# Altium project Vreg_Learning_Platform.PrjPcb (part 5 of 5)

## Sheet Output.SchDoc: <Project Name>
size A3; ApprovedBy: <Appr.>; Author: <Author>; CompanyName: Infineon Technologies AG; Engineer: <Rel.>; Organization: Infineon Technologies AG; Address1: IFAG DES S PS; Address2: Am Campeon 1-12  -  85579 Neubiberg  -  Germany; Address3: 85579 Neubiberg; Address4: Germany; DocumentNumber: 8; Revision: <Rev.>; SheetNumber: 8; SheetTotal: 9; Release: RC00; PageSetup: Record=PageOptions|CenterHorizontal=True|CenterVertical=True|PrintScale=1.01|XCorrection=1.00|YCorrection=1.00|PrintKind=0|BorderSize=5000000|LeftOffset=0|BottomOffset=0|Orientation=2|PaperLength=1000|PaperWidth=1000|Scale=100|PaperSource=7|PrintQuality=-4|MediaType=1|DitherType=10|PaperKind=A3|PrintScaleMode=1; Doc_ConfidentialStatus: <Doc_ConfidentialStatus>; Doc_Preliminary: <Doc_Preliminary>
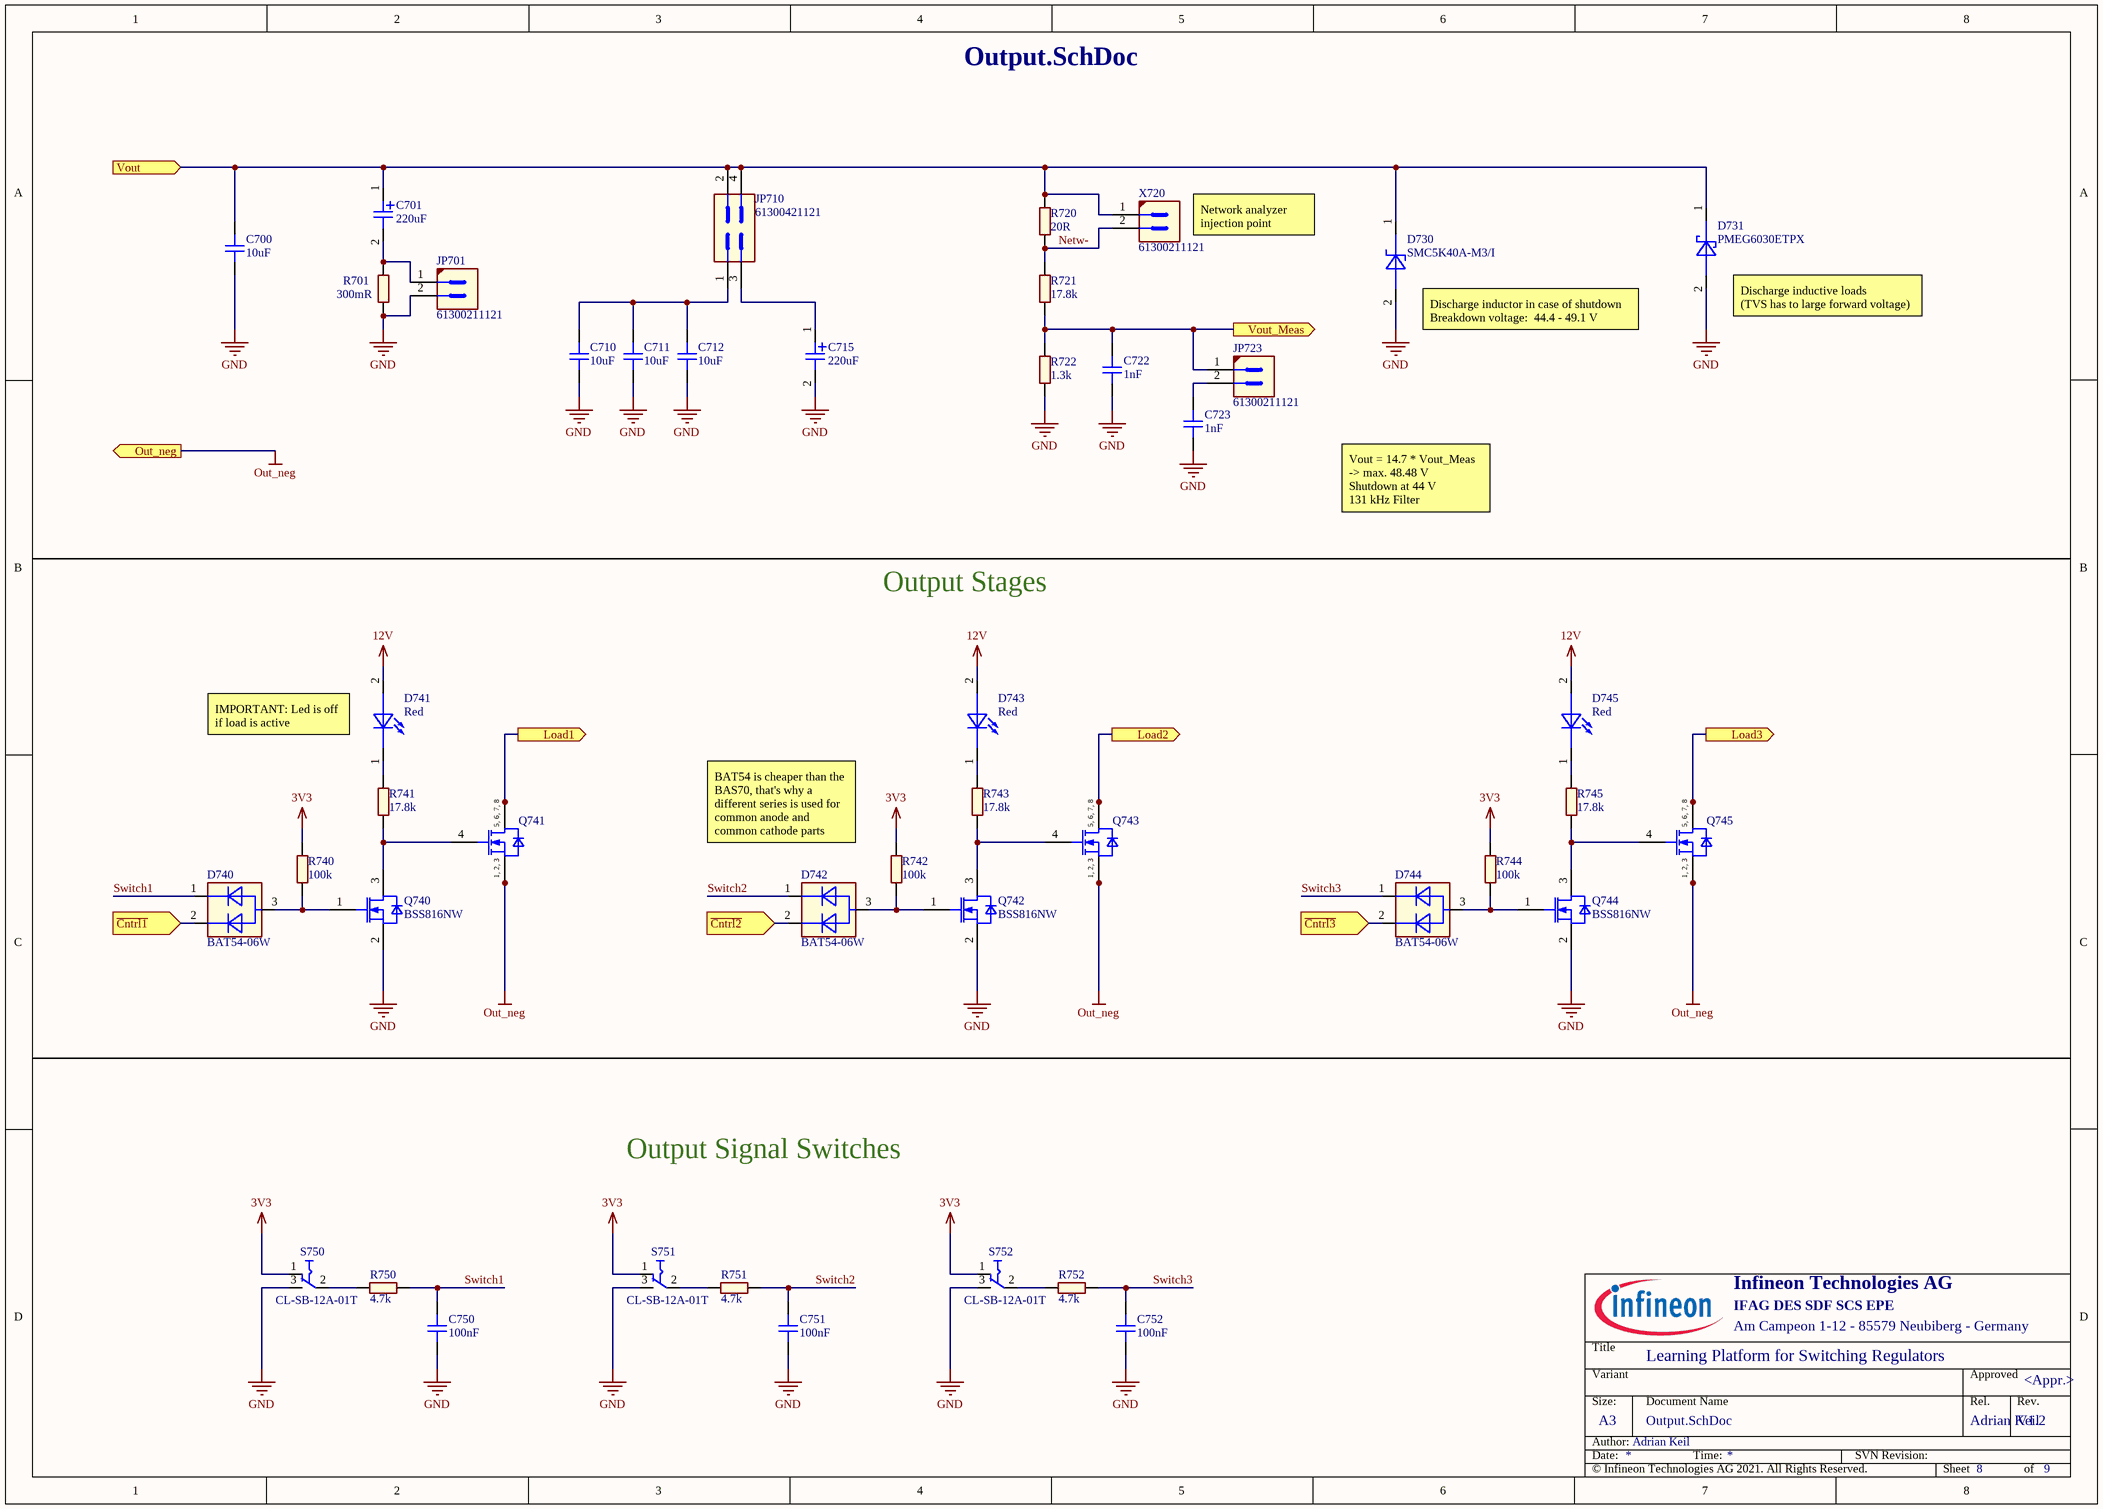
[diagram p5: Output.SchDoc]

### Parts
C700  10uF  [CAPC3216X190N-1]
C701  220uF  [CAPAE1030X1050N-2]
C710  10uF  [CAPC3216X190N-1]
C711  10uF  [CAPC3216X190N-1]
C712  10uF  [CAPC3216X190N-1]
C715  220uF  [CAPAE1030X1050N-2]
C722  1nF  [CAPC1608X87N-1]
C723  1nF  [CAPC1608X87N-1]
C750  100nF  [CAPC1608X90N-2]
C751  100nF  [CAPC1608X90N-2]
C752  100nF  [CAPC1608X90N-2]
D730  SMC5K40A-M3/I  [DIOM7959X262N]
D731  PMEG6030ETPX  [SODFL4725X110N]
D740  BAT54-06W  [SOT65P210X100-3N-1-V]
D741  Red  [LEDSC160X80X80-2N-1]
D742  BAT54-06W  [SOT65P210X100-3N-1-V]
D743  Red  [LEDSC160X80X80-2N-1]
D744  BAT54-06W  [SOT65P210X100-3N-1-V]
D745  Red  [LEDSC160X80X80-2N-1]
JP701  61300211121  [CON-M-THT-61300211121]
JP710  61300421121  [CON-M-THT-61300421121]
JP723  61300211121  [CON-M-THT-61300211121]
Q740  BSS816NW  [SOT65P210X100-3N-1-V]
Q741  igfet_n_ch_enh_dio_1s2s3s4g5d6d7d8d_8p  [INF-PG-TSDSON-8-FL]  (value not drawn)
Q742  BSS816NW  [SOT65P210X100-3N-1-V]
Q743  igfet_n_ch_enh_dio_1s2s3s4g5d6d7d8d_8p  [INF-PG-TSDSON-8-FL]  (value not drawn)
Q744  BSS816NW  [SOT65P210X100-3N-1-V]
Q745  igfet_n_ch_enh_dio_1s2s3s4g5d6d7d8d_8p  [INF-PG-TSDSON-8-FL]  (value not drawn)
R701  300mR  [RESC6432X89N-1]
R720  20R  [RESC1609X50N]
R721  17.8k  [RESC1609X50N]
R722  1.3k  [RESC1609X50N]
R740  100k  [RESC1609X50N]
R741  17.8k  [RESC1609X50N]
R742  100k  [RESC1609X50N]
R743  17.8k  [RESC1609X50N]
R744  100k  [RESC1609X50N]
R745  17.8k  [RESC1609X50N]
R750  4.7k  [RESC1609X50N]
R751  4.7k  [RESC1609X50N]
R752  4.7k  [RESC1609X50N]
S750  CL-SB-12A-01T  [SW-SMD-CL-SB-12A-01T]
S751  CL-SB-12A-01T  [SW-SMD-CL-SB-12A-01T]
S752  CL-SB-12A-01T  [SW-SMD-CL-SB-12A-01T]
X720  61300211121  [CON-M-THT-61300211121]

### Ports
Load1 (out), Load2 (out), Load3 (out), Out_neg (out), Vout (in), Vout_Meas (out), ~{Cntrl1} (in), ~{Cntrl2} (in), ~{Cntrl3} (in)

### Nets
3V3: R740.2 R742.2 R744.2 S750.1 S751.1 S752.1
12V: D741.2(Anode) D743.2(Anode) D745.2(Anode)
GND: C700.1 C710.1 C711.1 C712.1 C715.2 C722.1 C723.1 C750.1 C751.1 C752.1 D730.2(ANODE) D731.2(Anode) JP701.2 Q740.2(SOURCE) Q742.2(SOURCE) Q744.2(SOURCE) R701.1 R722.1 S750.3 S751.3 S752.3
Out_neg: Q741.1(SOURCE) Q741.2(SOURCE) Q741.3(SOURCE) Q743.1(SOURCE) Q743.2(SOURCE) Q743.3(SOURCE) Q745.1(SOURCE) Q745.2(SOURCE) Q745.3(SOURCE) ; port Out_neg
~{Cntrl1}: D740.2(CATHODE2) ; port ~{Cntrl1}
~{Cntrl2}: D742.2(CATHODE2) ; port ~{Cntrl2}
~{Cntrl3}: D744.2(CATHODE2) ; port ~{Cntrl3}
Load1: Q741.5(DRAIN) Q741.6(DRAIN) Q741.7(DRAIN) Q741.8(DRAIN) ; port Load1
Load2: Q743.5(DRAIN) Q743.6(DRAIN) Q743.7(DRAIN) Q743.8(DRAIN) ; port Load2
Load3: Q745.5(DRAIN) Q745.6(DRAIN) Q745.7(DRAIN) Q745.8(DRAIN) ; port Load3
Netw-: R720.1 R721.1 X720.2
Switch1: C750.2 D740.1(CATHODE1) R750.2
Switch2: C751.2 D742.1(CATHODE1) R751.2
Switch3: C752.2 D744.1(CATHODE1) R752.2
Vout: C700.2 C701.1 D730.1(CATHODE) D731.1(Cathode) JP710.2 JP710.4 R720.2 X720.1 ; port Vout
Vout_Meas: C722.2 JP723.1 R721.2 R722.2 ; port Vout_Meas
NetC701_2: C701.2 JP701.1 R701.2
NetC710_2: C710.2 C711.2 C712.2 JP710.1
NetC715_1: C715.1 JP710.3
NetC723_2: C723.2 JP723.2
NetD740_3: D740.3(ANODE) Q740.1(GATE) R740.1
NetD741_1: D741.1(Cathode) R741.2
NetD742_3: D742.3(ANODE) Q742.1(GATE) R742.1
NetD743_1: D743.1(Cathode) R743.2
NetD744_3: D744.3(ANODE) Q744.1(GATE) R744.1
NetD745_1: D745.1(Cathode) R745.2
NetQ740_3: Q740.3(DRAIN) Q741.4(GATE) R741.1
NetQ742_3: Q742.3(DRAIN) Q743.4(GATE) R743.1
NetQ744_3: Q744.3(DRAIN) Q745.4(GATE) R745.1
NetR750_1: R750.1 S750.2
NetR751_1: R751.1 S751.2
NetR752_1: R752.1 S752.2

### Notes on the sheet
- Network analyzer injection point
- (near D731) Discharge inductive loads
  (TVS has to large forward voltage)
- (near D730) Discharge inductor in case of shutdown
  Breakdown voltage:  44.4 - 49.1 V
- Vout = 14.7 * Vout_Meas
  -> max. 48.48 V
  Shutdown at 44 V
  131 kHz Filter
- Output Stages
- (near D741) IMPORTANT: Led is off if load is active
- BAT54 is cheaper than the BAS70, that's why a different series is used for common anode and common cathode parts
- Output Signal Switches
- Title
- Variant
- Approved
- Date:
- Author:
- Size:
- A3
- Document Name
- Time:
- SVN Revision:
- Rel.
- Rev.
- Sheet
- of
- (in symbol 422114) 5, 6, 7, 8; 1, 2, 3

### Library data of the parts
C700 C710-C712 = 648992: CAP / CERA / 10uF / 50V / 20% / X5R (EIA) / -55°C to 85°C / 1206 (3216) / SMD / -; Multiple Parts: No; Manufacturer: Taiyo Yuden; Manufacturer Order Number: UMK316BBJ106ML-T; Symbol Type: Capacitor; Single; Standard; 2 Pins; Alternate View: Yes; Article Number: 648992; Version Number: V00; Combined Parameters: TC:X5R (EIA);Tol.:-20%/+20%;Vdc:50V; QuickPick: 10uF / 50V / 20% / X5R (EIA) / 1206 (3216); Type: Standard; Style: Single; ComponentStatus: Released; PLMStatus: Active; Part Type: Capacitor; Value: 10uF; Tolerance Neg: 20%; Tolerance Pos: 20%; Application: Standard; Technology: Ceramic; Temperature min: -55; Temperature max: 85; Temperature Range: Military; ROHS Compliant: Y; Automotive Qualified: No; PackageReference: 1206 (3216); ComponentLink1Description: Vendor WebSite; ComponentLink1URL: http://www.yuden.co.jp/or/product/; ComponentLink2Description: Datasheet; ComponentLink2URL: http://webnetprod.muc.infineon.com/PCBPortal_Prod/WorkFlows/AltiumComponent/StandardDocumentation?Versionid=648993; Supplier 1: Farnell; Supplier Part Number 1: 2779059; Supplier 2: DigiKey; Supplier Part Number 2: 587-3248-1-ND; Supplier 3: Mouser; Supplier Part Number 3: 963-UMK316BBJ106ML-T; Second Source allowed: Yes; Voltage DC (max): 50V; Package Description: Capacitor,non-polarized,Chip;3.20mm L X 1.60mm W X 1.90mm H
C701 C715 = 646791: CAP / ELCO / 220uF / 50V / 20% / Aluminiumelectrolytic / -55°C to 105°C / 10.30mm L X 10.30mm W X 10.50mm H / SMD / -; Multible Parts: No; Manufacturer: Wurth Elektronik; Manufacturer Order Number: 865080657018; Symbol Type: Capacitor; Single; Polarized; 2 Pins; Pin 1 Positive; Alternate View: Yes; Article Number: 646791; Version Number: V01; Combined Parameters: TC:Aluminiumelectrolytic;Tol.:-20%/+20%;Vdc:50V; QuickPick: 220uF / 50V / 20% / Aluminiumelectrolytic / SMD; Type: Polarized; Style: Single; ComponentStatus: Released; PLMStatus: Active; Part Type: Capacitor; Value: 220uF; Tolerance Neg: 20%; Tolerance Pos: 20%; Application: Standard; Technology: Electrolytic; Temperature min: -55; Temperature max: 105; Temperature Range: Military; ROHS Compliant: Y; Automotive Qualified: No; PackageReference: SMD; ComponentLink1Description: Vendor WebSite; ComponentLink1URL: http://www.we-online.com; ComponentLink2Description: Datasheet; ComponentLink2URL: http://webnetprod.muc.infineon.com/PCBPortal_Prod/WorkFlows/AltiumComponent/StandardDocumentation?Versionid=646792; Supplier 1: Farnell; Supplier Part Number 1: 2466345; Supplier 2: DigiKey; Supplier Part Number 2: 732-8463-1-ND; Supplier 3: Mouser; Supplier Part Number 3: 710-865080657018; Second Source allowed: Yes; Voltage DC (max): 50V; Package Description: Capacitor,Aluminum Electrolytic;10.30mm L X 10.30mm W X 10.50mm H
C722 C723 = 527788: CAP / CERA / 1nF / 50V / 10% / X7R (EIA) / -55°C to 125°C / 0603 (1608) / SMD / -; Multiple Parts: No; Manufacturer: Wurth Elektronik; Manufacturer Order Number: 885012206083; Symbol Type: Capacitor; Single; Standard; 2 Pins; Alternate View: Yes; Article Number: 527788; Version Number: V01; Combined Parameters: TC:X7R (EIA);Tol.:-10%/+10%;Vdc:50V; QuickPick: 1nF / 50V / 10% / X7R (EIA) / 0603 (1608); Type: Standard; Style: Single; ComponentStatus: Released; PLMStatus: Active; Part Type: Capacitor; Value: 1nF; Tolerance Neg: 10%; Tolerance Pos: 10%; Application: Standard; Technology: Ceramic; Temperature min: -55; Temperature max: 125; Temperature Range: Military; ROHS Compliant: Y; Automotive Qualified: No; PackageReference: 0603 (1608); ComponentLink1Description: Vendor WebSite; ComponentLink1URL: http://www.we-online.com; ComponentLink2Description: Datasheet; ComponentLink2URL: http://webnetprod.muc.infineon.com/PCBPortal_Prod/WorkFlows/AltiumComponent/StandardDocumentation?Versionid=527789; Supplier 1: Farnell; Supplier Part Number 1: 2495178; Supplier 2: DigiKey; Supplier Part Number 2: 732-8001-1-ND; Supplier 3: Mouser; Supplier Part Number 3: 710-885012206083; Second Source allowed: Yes; Voltage DC (max): 50V; Package Description: Capacitor,non-polarized,Chip;1.60mm L X 0.80mm W X 0.87mm H
C750-C752 = 479045: CAP / CERA / 100nF / 50V / 10% / X7R (EIA) / -55°C to 125°C / 0603 / SMD / -; Multiple Parts: No; Manufacturer: AVX; Manufacturer Order Number: 06035C104KAT2A; Symbol Type: Capacitor; Single; Standard; 2 Pins; Alternate View: Yes; Article Number: 479045; Version Number: V01; Combined Parameters: TC:X7R (EIA);Tol.:-10%/+10%;Vdc:50V; QuickPick: 100nF / 50V / 10% / X7R (EIA) / 0603; Type: Standard; Style: Single; ComponentStatus: Released; PLMStatus: Active; Part Type: Capacitor; Value: 100nF; Tolerance Neg: 10%; Tolerance Pos: 10%; Application: Standard; Technology: Ceramic; Temperature min: -55; Temperature max: 125; Temperature Range: Military; ROHS Compliant: Y; Automotive Qualified: No; PackageReference: 0603; ComponentLink1Description: Vendor WebSite; ComponentLink1URL: http://www.avx.com; ComponentLink2Description: Datasheet; ComponentLink2URL: http://webnetprod.muc.infineon.com/PCBPortal_Prod/WorkFlows/AltiumComponent/StandardDocumentation?Versionid=479046; Supplier 1: Farnell; Supplier Part Number 1: 2280883; Supplier 2: DigiKey; Supplier Part Number 2: 478-5052-2-ND; Supplier 3: Mouser; Supplier Part Number 3: 581-06035C104KAT2A; Second Source allowed: Yes; Voltage DC (max): 50V; Package Description: Capacitor,non-polarized,Chip;1.60mm L X 0.81mm W X 0.90mm H
D730 = 646377: Surface Mount Transient Voltage Suppressors, Unidirectional, Very Fast Response Time; Manufacturer: Vishay; Symbol Type: Transient Voltage Suppressor Diode (TVS, TAZ), 1 Cathode, 2 Anode; Article Number: 646377; Version Number: V01; Combined Parameters: Vf:-;If:-;Ur:40V;Ir:-;Pmax:5kW; QuickPick: TVS Diode / SMC (DO-214AB); Type: TVS Diode; Style: Single; Automotive Qualified: AEC Q101; ComponentStatus: Released; PLMStatus: Active; Second Source allowed: Yes; Voltage DC (max): na; Part Type: Diode; Manufacturer Order Number: SMC5K40A-M3/I; Value: SMC5K40A-M3/I; Application: Switching; Temperature min: -55; Temperature max: 150; Temperature Range: Military; ROHS Compliant: Y; PackageReference: SMC (DO-214AB); ComponentLink1Description: Vendor WebSite; ComponentLink1URL: http://www.vishay.com; ComponentLink2Description: Datasheet; ComponentLink2URL: http://webnetprod.muc.infineon.com/PCBPortal_Prod/WorkFlows/AltiumComponent/StandardDocumentation?Versionid=646378; Supplier 1: Farnell; Supplier 2: DigiKey; Supplier Part Number 2: SMC5K40A-M3/IGICT-ND; Supplier 3: Mouser; Supplier Part Number 3: 78-SMC5K40A-M3/I; Package Description: Diode,Molded Body;7.94mm L X 5.905mm W X 2.62mm H
D731 = 646087: DIODE SCHOTTKY 60V 3A SOD128; Manufacturer: Nexperia; Symbol Type: Standard Schottky Diode Symbol, 1 Cathode, 2 Anode; Article Number: 646087; Version Number: V01; Combined Parameters: Vf:530mV;If:4.2A;Ur:60V;Ir:200uA;Pmax:750mW; QuickPick: Schottky Diode / SOD128; Type: Schottky Diode; Style: Single; Automotive Qualified: AEC Q101; ComponentStatus: Released; PLMStatus: Active; Second Source allowed: Yes; Voltage DC (max): na; Part Type: Diode; Manufacturer Order Number: PMEG6030ETPX; Value: PMEG6030ETPX; Application: Standard; Temperature min: -55; Temperature max: 175; Temperature Range: Military; ROHS Compliant: Y; PackageReference: SOD128; ComponentLink1Description: Vendor WebSite; ComponentLink1URL: http://www.nexperia.com; ComponentLink2Description: Datasheet; ComponentLink2URL: http://webnetprod.muc.infineon.com/PCBPortal_Prod/WorkFlows/AltiumComponent/StandardDocumentation?Versionid=646088; Supplier 1: Farnell; Supplier Part Number 1: 2311228; Supplier 2: DigiKey; Supplier Part Number 2: 1727-1348-1-ND; Supplier 3: Mouser; Supplier Part Number 3: 771-PMEG6030ETPX; Package Description: SODFL Diode;3.80mm W X 2.50mm L X 1.10mm H body
D740 D742 D744 = 646372: Silicon Schottky Diodes; Manufacturer: Infineon Technologies; Symbol type: Dual Diode Symbol 3 Pins, 1 Cathode, 2 Cathode, 3 Anode; Article Number: 646372; Version Number: V01; Combined Parameters: Vf:800mV;If:200mA;Ur:30V;Ir:2uA;Pmax:230mW; QuickPick: Schottky Diode / PG-SOT323-3-1; Style: Dual; Automotive Qualified: AEC Q101; ComponentStatus: Released; PLMStatus: Active; Second Source allowed: Yes; Voltage DC (max): na; Part Type: Diode; Manufacturer Order Number: BAT54-06W; Value: BAT54-06W; Type: Schottky Diode; Application: Standard; Temperature min: -65; Temperature max: 150; Temperature Range: Military; ROHS Compliant: Y; PackageReference: PG-SOT323-3-1; ComponentLink1Description: Vendor WebSite; ComponentLink1URL: https://www.infineon.com/; ComponentLink2Description: Datasheet; ComponentLink2URL: http://webnetprod.muc.infineon.com/PCBPortal_Prod/WorkFlows/AltiumComponent/StandardDocumentation?Versionid=646373; Supplier 1: Farnell; Supplier Part Number 1: 2787842; Supplier 2: DigiKey; Supplier Part Number 2: BAT5406WH6327XTSA1TR-ND; Supplier 3: Mouser; Package Description: SOT,0.65mm pitch;3 pin,1.25mm W X 2.00mm L X 1.00mm H body
D741 D743 D745 = 625459: as D550-D553 on sheet Safety; Part Type: Diode; Value: Red; Type: LED; Application: Standard; Temperature min: -40; Temperature max: 85; Temperature Range: Industrial; ROHS Compliant: Y; PackageReference: 1608 (0603); ComponentLink1Description: Vendor WebSite; ComponentLink1URL: http://www.we-online.com; ComponentLink2Description: Datasheet; ComponentLink2URL: http://webnetprod.muc.infineon.com/PCBPortal_Prod/WorkFlows/AltiumComponent/StandardDocumentation?Versionid=625460; Supplier 1: Farnell; Supplier Part Number 1: 2322071; Supplier 2: DigiKey; Supplier Part Number 2: 732-4978-1-ND; Supplier 3: Mouser; Supplier Part Number 3: 710-150060RS75000; Package Description: LED,Side Concave; 2 pin,1.60mm W X 0.80mm L X 0.80mm H
JP701 JP723 X720 = 386760: Header, 2.54mm Pitch, 2 pin, Vertical, Single Row; Legacy PartNumber: CON01500943; Manufacturer: Wurth Elektronik; Alternat View: Yes; Article Number: 386760; Version Number: V01; Legacy DeviceID: WE_61300211121; Combined Parameters: Board-to-Board Header (male);2x1;Mounting:THT;Orient:0° (vertical);Shielded:No; QuickPick: 0° (vertical) / Board-to-Board; Style: Strip; Automotive Qualified: No; ComponentStatus: Released; PLMStatus: Active; Voltage DC (max): na; Part Type: Connector; Manufacturer Order Number: 61300211121; Value: 61300211121; Type: Board-to-Board; Temperature min: -40; Temperature max: 105; Temperature Range: Industrial; ROHS Compliant: Y; ComponentLink1Description: Vendor WebSite; ComponentLink1URL: http://www.we-online.com; ComponentLink2Description: Datasheet; ComponentLink2URL: http://webnetprod.muc.infineon.com/PCBPortal_Prod/WorkFlows/AltiumComponent/StandardDocumentation?Versionid=386761; Supplier 1: Farnell; Supplier Part Number 1: 2356153; Supplier 2: DigiKey; Supplier Part Number 2: 732-5315-ND; Supplier 3: Mouser; Supplier Part Number 3: 710-61300211121; Second Source allowed: Yes; Package Description: Header, Vertical, 2.54mm Pitch; 2 Pins, Single row, 5.08mm L X 2.54mm W X 8.89mm H body
JP710 = 624445: Header, 4pins, 2.54mm pitch, Board to Board; Manufacturer: Wurth Elektronik; Article Number: 624445; Version Number: V01; Legacy DeviceID: WE_61300421121; Combined Parameters: Board-to-Board Header (male);2x2;Mounting:THT;Orient:0° (vertical);Shielded:No; QuickPick: 0° (vertical) / Board-to-Board; Style: Strip; Automotive Qualified: No; ComponentStatus: Released; PLMStatus: Active; Second Source allowed: Yes; Voltage DC (max): na; Part Type: Connector; Manufacturer Order Number: 61300421121; Value: 61300421121; Type: Board-to-Board; Temperature min: -40; Temperature max: 105; Temperature Range: Industrial; ROHS Compliant: Y; PackageReference: THT; ComponentLink1Description: Vendor WebSite; ComponentLink1URL: http://www.we-online.com; ComponentLink2Description: Datasheet; ComponentLink2URL: http://webnetprod.muc.infineon.com/PCBPortal_Prod/WorkFlows/AltiumComponent/StandardDocumentation?Versionid=624446; Supplier 1: Farnell; Supplier Part Number 1: 2356130; Supplier 2: DigiKey; Supplier Part Number 2: 732-5294-ND; Supplier 3: Mouser; Supplier Part Number 3: 710-61300421121; Package Description: Connector, THT, 2.54mm pitch, 4 pins,5.08mm L X 5.08mm W X 8.89mm H body
Q740 Q742 Q744 = 644598: as Q550-Q553 on sheet Safety; Part Type: Transistor FET; Manufacturer Order Number: BSS816NW; Value: BSS816NW; Application: Small Signal; Temperature min: -55; Temperature max: 150; Temperature Range: Military; ROHS Compliant: Y; PackageReference: PG-SOT323-3-2; ComponentLink1Description: Vendor WebSite; ComponentLink1URL: https://www.infineon.com/; ComponentLink2Description: Datasheet; ComponentLink2URL: http://webnetprod.muc.infineon.com/PCBPortal_Prod/WorkFlows/AltiumComponent/StandardDocumentation?Versionid=644599; Supplier 1: Farnell; Supplier Part Number 1: 2617470; Supplier 2: DigiKey; Supplier Part Number 2: BSS816NWH6327XTSA1CT-ND; Supplier 3: Mouser; Supplier Part Number 3: 726-SP000917562; Package Description: SOT,0.65mm pitch;3 pin,1.25mm W X 2.00mm L X 1.00mm H body
Q741 Q743 Q745 = 422114: OptiMOS Power - MOSFET, 60 V; Legacy PartNumber: IFX01400359; Manufacturer: Infineon Technologies; Manufacturer Order Number: BSZ100N06NS; Symbol Type: Insulated-Gate Field-Effect Transistor (IGFET), N-Channel, Enhancement, Body Diode, Pin 1 Source, 2 Source, 3 Source, 4 Gate, 5 Drain, 6 Drain, 7 Drain, 8 Drain, 8 Pins; Article Number: 422114; Version Number: V01; Legacy DeviceID: IFX_BSZ100N06NS; Value: BSZ100N06NS; Combined Parameters: N-Channel;Uds:60V;Id:40A;Rds:10mR;P:36W; QuickPick: N-Channel / 36W / 40A / 60V / PG-TSDSON-8 FL; Type: N-Channel; Style: Single; Automotive Qualified: No; ComponentStatus: Released; PLMStatus: Active; Second Source allowed: Yes; Voltage DC (max): na; Part Type: Transistor FET; Application: Power Supply; Temperature min: -55; Temperature max: 150; Temperature Range: Military; ROHS Compliant: N; PackageReference: PG-TSDSON-8 FL; ComponentLink1Description: Vendor WebSite; ComponentLink1URL: https://www.infineon.com/; ComponentLink2Description: Datasheet; ComponentLink2URL: http://webnetprod.muc.infineon.com/PCBPortal_Prod/WorkFlows/AltiumComponent/StandardDocumentation?Versionid=422115; Supplier 1: Farnell; Supplier Part Number 1: 2709918; Supplier 2: DigiKey; Supplier Part Number 2: BSZ100N06NSATMA1TR-ND; Supplier 3: Mouser; Supplier Part Number 3: 726-BSZ100N06NSATMA1; Package Description: SON,0.65mm pitch;8 pin,3.3mm W X 3.3mm L X 1.10mm H body
R701 = 513799: RES / STD / 300mR / 1W / 1% / 75ppm/K / -65°C to 170°C / 2512 / SMD / -; Multiple Parts: No; Manufacturer: Vishay; Manufacturer Order Number: WSL2512R3000FEA; Symbol Type: Resistor; Single; Standard; 2 Pins; Alternate View: Yes; Article Number: 513799; Version Number: V01; Combined Parameters: TCR:75ppm/K;Tol.:-1%/+1%;Vdc:-;Idc:-;P:1W; QuickPick: 300mR / 1% / 1 / 2512; Style: Single; Automotive Qualified: AEC Q200; ComponentStatus: Released; PLMStatus: Active; Part Type: Resistor; Value: 300mR; Tolerance Neg: 1%; Tolerance Pos: 1%; Type: Standard; Application: Standard; Technology: Power Metal Strip; Temperature min: -65; Temperature max: 170; Temperature Range: Military; ROHS Compliant: Y; PackageReference: 2512; ComponentLink1Description: Vendor WebSite; ComponentLink1URL: http://www.vishay.com; ComponentLink2Description: Datasheet; ComponentLink2URL: http://webnetprod.muc.infineon.com/PCBPortal_Prod/WorkFlows/AltiumComponent/StandardDocumentation?Versionid=513800; Supplier 1: Farnell; Supplier Part Number 1: 1107412; Supplier 2: DigiKey; Supplier Part Number 2: WSLG-.30CT-ND; Supplier 3: Mouser; Supplier Part Number 3: 71-WSL2512R3000FEA; Second Source allowed: Yes; Package Description: Resistor,Chip;6.35mm L X 3.18mm W X 0.889mm H
R720 = 344622: RES / STD / 20R / 100mW / 1% / 100ppm/K / -55°C to 155°C / 0603 / SMD / -; Multiple Parts: No; Legacy PartNumber: RES01800947; Manufacturer: Vishay; Manufacturer Order Number: CRCW060320R0FK; Symbol Type: Resistor; Single; Standard; 2 Pins; Alternate View: Yes; Article Number: 344622; Version Number: V01; Combined Parameters: TCR:100ppm/K;Tol.:-1%/+1%;Vdc:75V;Idc:-;P:100mW; QuickPick: 20R / 1% / 0.1 / 0603; Style: Single; Automotive Qualified: AEC Q200; ComponentStatus: Released; PLMStatus: Active; Voltage DC (max): 75V; Legacy DeviceID: RES01800947; Part Type: Resistor; Value: 20R; Tolerance Neg: 1%; Tolerance Pos: 1%; Type: Standard; Technology: Thick Film; Temperature min: -55; Temperature max: 155; Temperature Range: Military; ROHS Compliant: Y; PackageReference: 0603; ComponentLink1Description: Vendor WebSite; ComponentLink1URL: http://www.vishay.com; ComponentLink2Description: Datasheet; ComponentLink2URL: http://webnetprod.muc.infineon.com/PCBPortal_Prod/WorkFlows/AltiumComponent/StandardDocumentation?Versionid=344623; Supplier 1: Farnell; Supplier 2: DigiKey; Supplier 3: Mouser; Second Source allowed: Yes
R721 R741 R743 R745 = 346302: RES / STD / 17.8k / 100mW / 1% / 100ppm/K / -55°C to 155°C / 0603 / SMD / -; Multiple Parts: No; Legacy PartNumber: RES01801283; Manufacturer: Vishay; Manufacturer Order Number: CRCW060317K8FK; Symbol Type: Resistor; Single; Standard; 2 Pins; Alternate View: Yes; Article Number: 346302; Version Number: V01; Combined Parameters: TCR:100ppm/K;Tol.:-1%/+1%;Vdc:75V;Idc:-;P:100mW; QuickPick: 17.8k / 1% / 0.1 / 0603; Style: Single; Automotive Qualified: AEC Q200; ComponentStatus: Released; PLMStatus: Active; Voltage DC (max): 75V; Legacy DeviceID: RES01801283; Part Type: Resistor; Value: 17.8k; Tolerance Neg: 1%; Tolerance Pos: 1%; Type: Standard; Technology: Thick Film; Temperature min: -55; Temperature max: 155; Temperature Range: Military; ROHS Compliant: Y; PackageReference: 0603; ComponentLink1Description: Vendor WebSite; ComponentLink1URL: http://www.vishay.com; ComponentLink2Description: Datasheet; ComponentLink2URL: http://webnetprod.muc.infineon.com/PCBPortal_Prod/WorkFlows/AltiumComponent/StandardDocumentation?Versionid=346303; Supplier 1: Farnell; Supplier 2: DigiKey; Supplier 3: Mouser; Second Source allowed: Yes
R722 = 345662: RES / STD / 1.3k / 100mW / 1% / 100ppm/K / -55°C to 155°C / 0603 / SMD / -; Multiple Parts: No; Legacy PartNumber: RES01801155; Manufacturer: Vishay; Manufacturer Order Number: CRCW06031K30FK; Symbol Type: Resistor; Single; Standard; 2 Pins; Alternate View: Yes; Article Number: 345662; Version Number: V01; Combined Parameters: TCR:100ppm/K;Tol.:-1%/+1%;Vdc:75V;Idc:-;P:100mW; QuickPick: 1.3k / 1% / 0.1 / 0603; Style: Single; Automotive Qualified: AEC Q200; ComponentStatus: Released; PLMStatus: Active; Voltage DC (max): 75V; Legacy DeviceID: RES01801155; Part Type: Resistor; Value: 1.3k; Tolerance Neg: 1%; Tolerance Pos: 1%; Type: Standard; Technology: Thick Film; Temperature min: -55; Temperature max: 155; Temperature Range: Military; ROHS Compliant: Y; PackageReference: 0603; ComponentLink1Description: Vendor WebSite; ComponentLink1URL: http://www.vishay.com; ComponentLink2Description: Datasheet; ComponentLink2URL: http://webnetprod.muc.infineon.com/PCBPortal_Prod/WorkFlows/AltiumComponent/StandardDocumentation?Versionid=345663; Supplier 1: Farnell; Supplier 2: DigiKey; Supplier 3: Mouser; Second Source allowed: Yes
R740 R742 R744 = 346742: RES / STD / 100k / 100mW / 1% / 100ppm/K / -55°C to 155°C / 0603 / SMD / -; Multiple Parts: No; Legacy PartNumber: RES01801371; Manufacturer: Vishay; Manufacturer Order Number: CRCW0603100KFK; Symbol Type: Resistor; Single; Standard; 2 Pins; Alternate View: Yes; Article Number: 346742; Version Number: V01; Combined Parameters: TCR:100ppm/K;Tol.:-1%/+1%;Vdc:75V;Idc:-;P:100mW; QuickPick: 100k / 1% / 0.1 / 0603; Style: Single; Automotive Qualified: AEC Q200; ComponentStatus: Released; PLMStatus: Active; Voltage DC (max): 75V; Legacy DeviceID: RES01801371; Part Type: Resistor; Value: 100k; Tolerance Neg: 1%; Tolerance Pos: 1%; Type: Standard; Technology: Thick Film; Temperature min: -55; Temperature max: 155; Temperature Range: Military; ROHS Compliant: Y; PackageReference: 0603; ComponentLink1Description: Vendor WebSite; ComponentLink1URL: http://www.vishay.com; ComponentLink2Description: Datasheet; ComponentLink2URL: http://webnetprod.muc.infineon.com/PCBPortal_Prod/WorkFlows/AltiumComponent/StandardDocumentation?Versionid=346743; Supplier 1: Farnell; Supplier Part Number 1: 1469649; Supplier 2: DigiKey; Supplier 3: Mouser; Second Source allowed: Yes
R750-R752 = 345982: RES / STD / 4.7k / 100mW / 1% / 100ppm/K / -55°C to 155°C / 0603 / SMD / -; Multiple Parts: No; Legacy PartNumber: RES01801219; Manufacturer: Vishay; Manufacturer Order Number: CRCW06034K70FK; Symbol Type: Resistor; Single; Standard; 2 Pins; Alternate View: Yes; Article Number: 345982; Version Number: V01; Combined Parameters: TCR:100ppm/K;Tol.:-1%/+1%;Vdc:75V;Idc:-;P:100mW; QuickPick: 4.7k / 1% / 0.1 / 0603; Style: Single; Automotive Qualified: AEC Q200; ComponentStatus: Released; PLMStatus: Active; Voltage DC (max): 75V; Legacy DeviceID: RES01801219; Part Type: Resistor; Value: 4.7k; Tolerance Neg: 1%; Tolerance Pos: 1%; Type: Standard; Technology: Thick Film; Temperature min: -55; Temperature max: 155; Temperature Range: Military; ROHS Compliant: Y; PackageReference: 0603; ComponentLink1Description: Vendor WebSite; ComponentLink1URL: http://www.vishay.com; ComponentLink2Description: Datasheet; ComponentLink2URL: http://webnetprod.muc.infineon.com/PCBPortal_Prod/WorkFlows/AltiumComponent/StandardDocumentation?Versionid=345983; Supplier 1: Farnell; Supplier 2: DigiKey; Supplier 3: Mouser; Second Source allowed: Yes
S750-S752 = 650099: Slid Switch, 12V, 200mA; Manufacturer: NIDEC COPAL ELECTRONICS, Inc.; Symbol Type: Switch, 2 Change Over 1 3, 3 Pins; Article Number: 650099; Version Number: V00; Automotive Qualified: No; ComponentStatus: Released; PLMStatus: Active; Second Source allowed: Yes; Voltage DC (max): na; Part Type: Electro Mechanic; Manufacturer Order Number: CL-SB-12A-01T; Value: CL-SB-12A-01T; Application: Power; Temperature min: -40; Temperature max: 85; Temperature Range: Industrial; ROHS Compliant: Y; ComponentLink1Description: Vendor WebSite; ComponentLink1URL: www.copal-electronics.com/; ComponentLink2Description: Datasheet; ComponentLink2URL: http://webnetprod.muc.infineon.com/PCBPortal_Prod/WorkFlows/AltiumComponent/StandardDocumentation?Versionid=650100; Supplier 1: Farnell; Supplier Part Number 1: 2854744; Supplier 2: DigiKey; Supplier Part Number 2: 563-1314-1-ND; Supplier 3: Mouser; Supplier Part Number 3: 229-CL-SB-12A-01T; Package Description: Switch, SMD, 3 Pins, 3.50 mm W X 8.50 mm L X 6.10 mm H body

## Sheet CurrentSensors.SchDoc: <Project Name>
size A3; ApprovedBy: <Appr.>; Author: <Author>; CompanyName: Infineon Technologies AG; Engineer: <Rel.>; Organization: Infineon Technologies AG; Address1: IFAG DES S PS; Address2: Am Campeon 1-12  -  85579 Neubiberg  -  Germany; Address3: 85579 Neubiberg; Address4: Germany; DocumentNumber: 7; Revision: <Rev.>; SheetNumber: 7; SheetTotal: 9; Release: RC00; PageSetup: Record=PageOptions|CenterHorizontal=True|CenterVertical=True|PrintScale=1.01|XCorrection=1.00|YCorrection=1.00|PrintKind=0|BorderSize=5000000|LeftOffset=0|BottomOffset=0|Orientation=2|PaperLength=1000|PaperWidth=1000|Scale=100|PaperSource=7|PrintQuality=-4|MediaType=1|DitherType=10|PaperKind=A3|PrintScaleMode=1; Doc_ConfidentialStatus: <Doc_ConfidentialStatus>; Doc_Preliminary: <Doc_Preliminary>
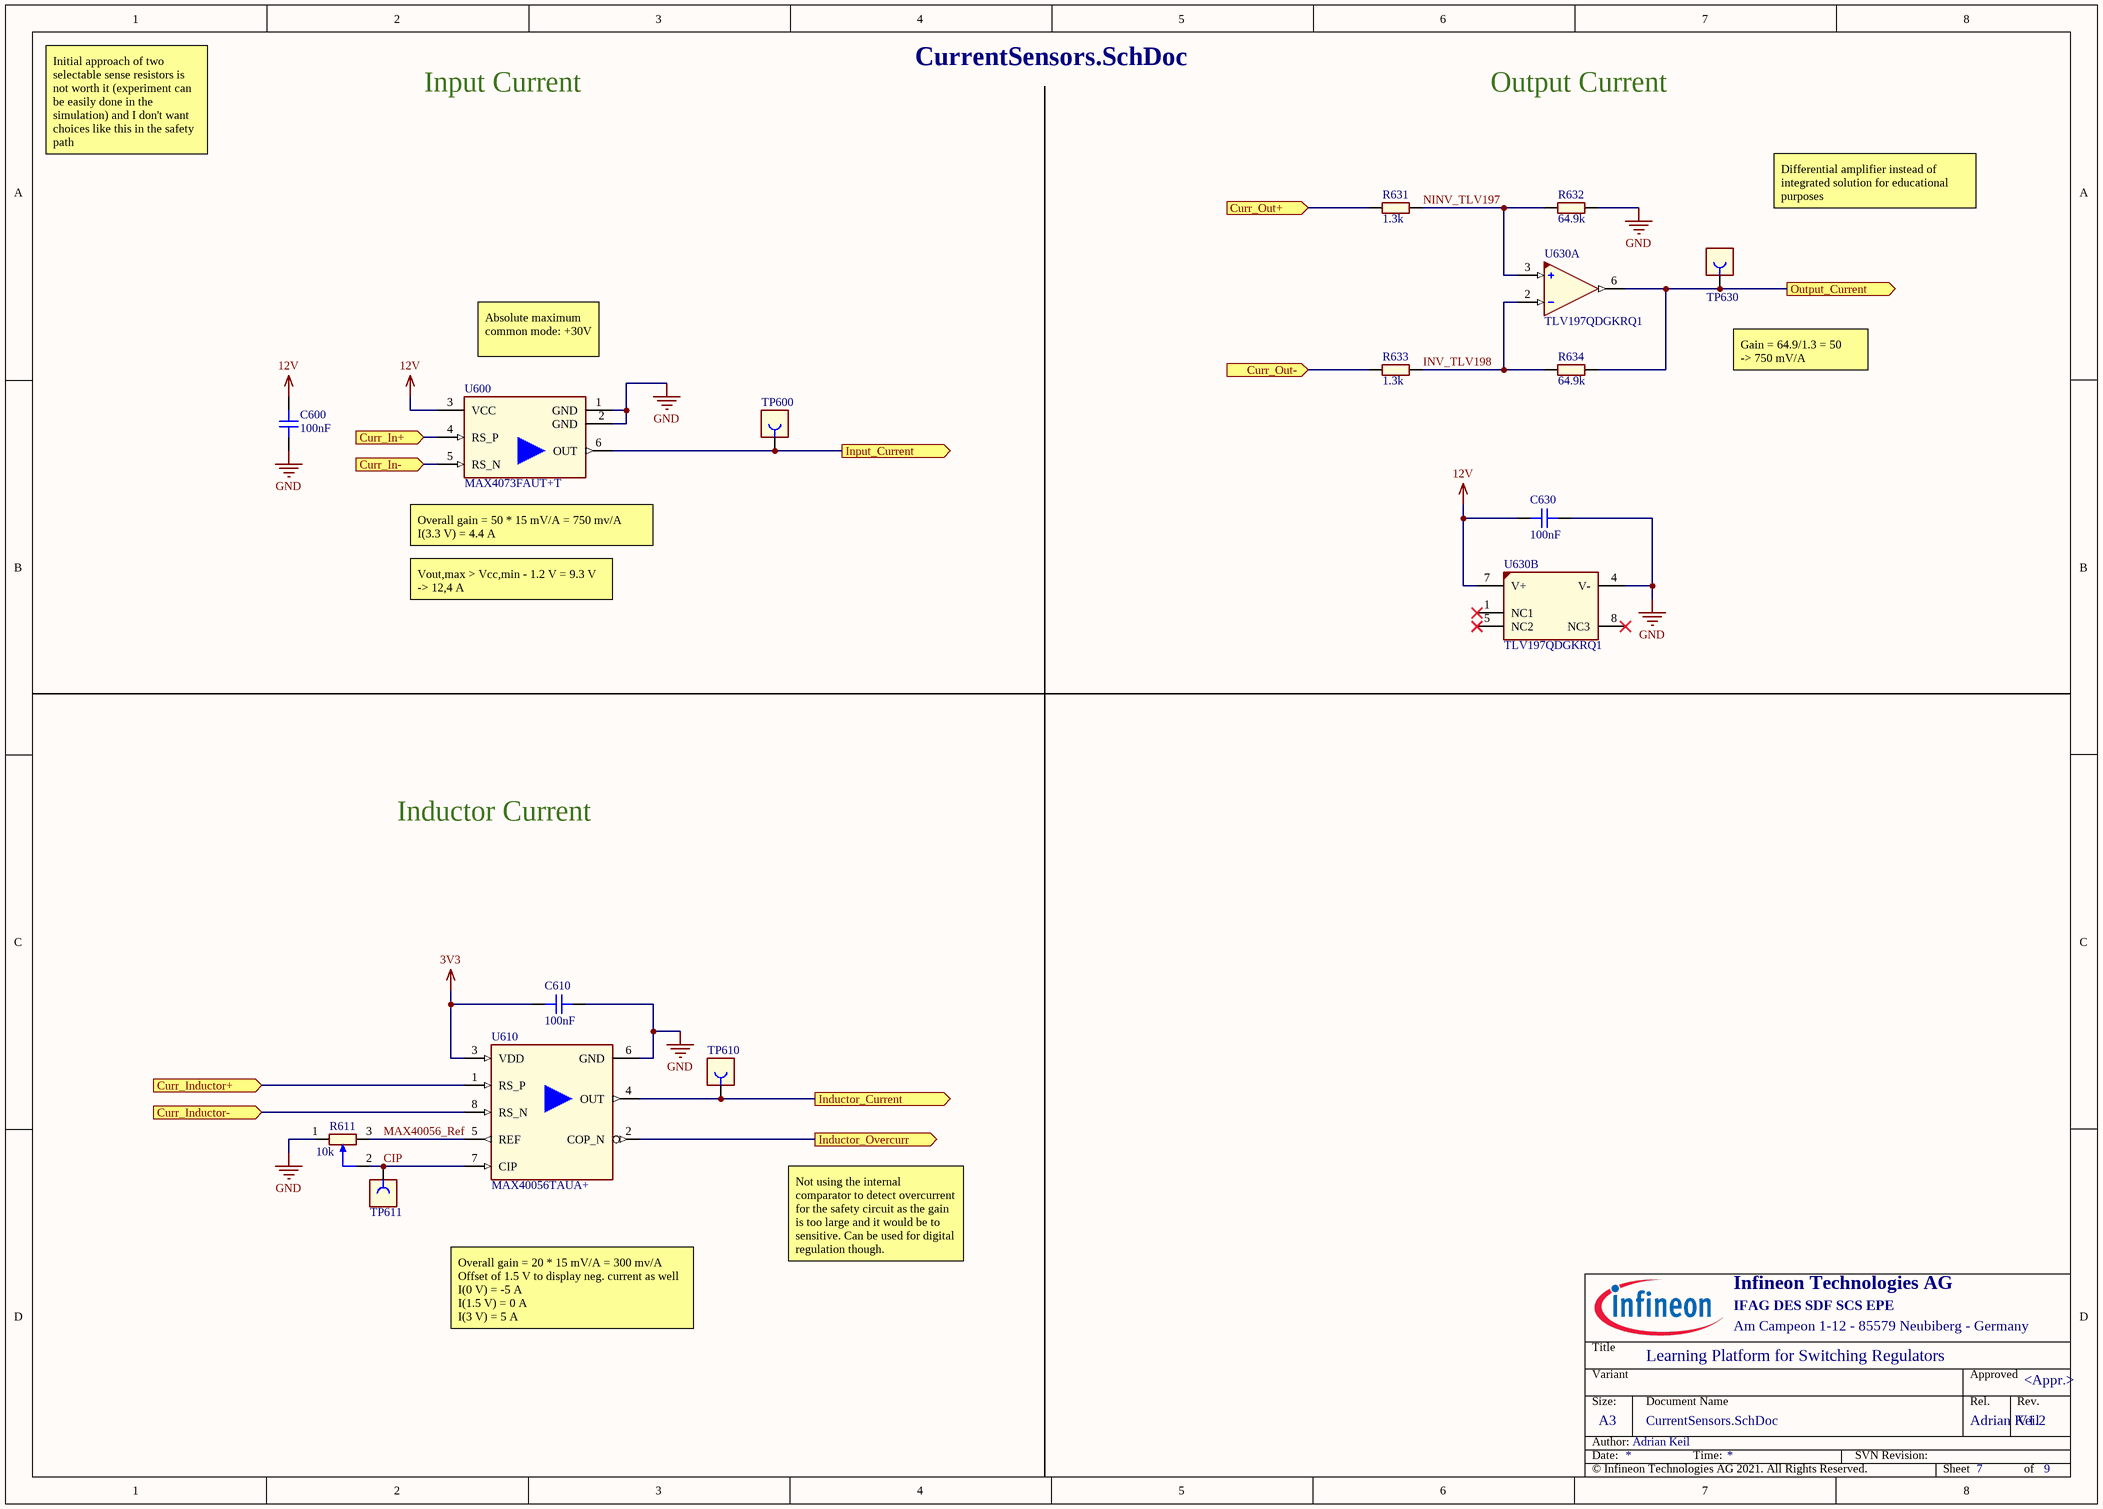
[diagram p6: CurrentSensors.SchDoc]

### Parts
C600  100nF  [CAPC1608X90N-2]
C610  100nF  [CAPC1608X90N-2]
C630  100nF  [CAPC1608X90N-2]
R611  10k  [POT-SMD-3361P]
R631  1.3k  [RESC1609X50N]
R632  64.9k  [RESC1609X50N]
R633  1.3k  [RESC1609X50N]
R634  64.9k  [RESC1609X50N]
TP600  S1751-46R  [CON-SMD-TT-S1751-46]  (value not drawn)
TP610  S1751-46R  [CON-SMD-TT-S1751-46]  (value not drawn)
TP611  S1751-46R  [CON-SMD-TT-S1751-46]  (value not drawn)
TP630  S1751-46R  [CON-SMD-TT-S1751-46]  (value not drawn)
U600  MAX4073FAUT+T  [SOT95P280X145-6N-2-V]
U610  MAX40056TAUA+  [SOP65P490X110-8N-4]
U630  TLV197QDGKRQ1  [SOP65P490X110-8N-V]  (parts A,B of 2)

### Ports
Curr_In+ (in), Curr_In- (in), Curr_Inductor+ (in), Curr_Inductor- (in), Curr_Out+ (in), Curr_Out- (in), Inductor_Current (out), Inductor_Overcurr (out), Input_Current (out), Output_Current (out)

### Nets
3V3: C610.2 U610.3(VDD)
12V: C600.2 C630.2 U600.3(VCC) U630.7(V+)
GND: C600.1 C610.1 C630.1 R611.1 R632.1 U600.1(GND) U600.2(GND) U610.6(GND) U630.4(V-)
CIP: R611.2 TP611.1 U610.7(CIP)
Curr_In+: U600.4(RS_P) ; port Curr_In+
Curr_In-: U600.5(RS_N) ; port Curr_In-
Curr_Inductor+: U610.1(RS_P) ; port Curr_Inductor+
Curr_Inductor-: U610.8(RS_N) ; port Curr_Inductor-
Curr_Out+: R631.1 ; port Curr_Out+
Curr_Out-: R633.1 ; port Curr_Out-
Inductor_Current: TP610.1 U610.4(OUT) ; port Inductor_Current
Inductor_Overcurr: U610.2(COP_N) ; port Inductor_Overcurr
Input_Current: TP600.1 U600.6(OUT) ; port Input_Current
INV_TLV198: R633.2 R634.1 U630.2(IN_N)
MAX40056_Ref: R611.3 U610.5(REF)
NINV_TLV197: R631.2 R632.2 U630.3(IN_P)
Output_Current: R634.2 TP630.1 U630.6(OUT) ; port Output_Current

Not connected (* = marked no-connect by the designer): U630 1(NC1)* 5(NC2)* 8(NC3)*

### Notes on the sheet
- Input Current
- Output Current
- Initial approach of two selectable sense resistors is not worth it (experiment can be easily done in the simulation) and I don't want choices like this in the safety path
- Differential amplifier instead of integrated solution for educational purposes
- Absolute maximum common mode: +30V
- Gain = 64.9/1.3 = 50
  -> 750 mV/A
- (near U600) Overall gain = 50 * 15 mV/A = 750 mv/A
  I(3.3 V) = 4.4 A
- Vout,max > Vcc,min - 1.2 V = 9.3 V
  -> 12,4 A
- Inductor Current
- Not using the internal comparator to detect overcurrent for the safety circuit as the gain is too large and it would be to sensitive. Can be used for digital regulation though.
- Overall gain = 20 * 15 mV/A = 300 mv/A
  Offset of 1.5 V to display neg. current as well
  I(0 V) = -5 A
  I(1.5 V) = 0 A
  I(3 V) = 5 A
- Title
- Variant
- Approved
- Date:
- Author:
- Size:
- A3
- Document Name
- Time:
- SVN Revision:
- Rel.
- Rev.
- Sheet
- of

### Library data of the parts
C600 C610 C630 = 479045: as C750 on sheet Output; Part Type: Capacitor; Value: 100nF; Tolerance Neg: 10%; Tolerance Pos: 10%; Application: Standard; Technology: Ceramic; Temperature min: -55; Temperature max: 125; Temperature Range: Military; ROHS Compliant: Y; Automotive Qualified: No; PackageReference: 0603; ComponentLink1Description: Vendor WebSite; ComponentLink1URL: http://www.avx.com; ComponentLink2Description: Datasheet; ComponentLink2URL: http://webnetprod.muc.infineon.com/PCBPortal_Prod/WorkFlows/AltiumComponent/StandardDocumentation?Versionid=479046; Supplier 1: Farnell; Supplier Part Number 1: 2280883; Supplier 2: DigiKey; Supplier Part Number 2: 478-5052-2-ND; Supplier 3: Mouser; Supplier Part Number 3: 581-06035C104KAT2A; Second Source allowed: Yes; Voltage DC (max): 50V; Package Description: Capacitor,non-polarized,Chip;1.60mm L X 0.81mm W X 0.90mm H
R611 = 630020: RES / VAR / 10k / 500mW / 10% / 100ppm/K / -55°C to 125°C /  3 pin, 7.04 mm L X 6.71 mm W X 5.84 mm H Body / SMD / -; Multiple Parts: No; Manufacturer: Bourns; Manufacturer Order Number: 3361P-1-103GLF; Alternate View: Yes; Symbol Type: Resistor; Single; Variable; 3 Pins; Article Number: 630020; Version Number: V01; Combined Parameters: TCR:100ppm/K;Tol.:-10%/+10%;Vdc:-;Idc:-;P:500mW; QuickPick: 10k / 10% / 0.5 / SMD; Style: Single; ComponentStatus: Released; PLMStatus: Active; Part Type: Resistor; Value: 10k; Tolerance Neg: 10%; Tolerance Pos: 10%; Type: Variable; Application: Standard; Temperature min: -55; Temperature max: 125; Temperature Range: Military; ROHS Compliant: Y; Automotive Qualified: No; PackageReference: SMD; ComponentLink1Description: Vendor WebSite; ComponentLink1URL: http://www.bourns.com; ComponentLink2Description: Datasheet; ComponentLink2URL: http://webnetprod.muc.infineon.com/PCBPortal_Prod/WorkFlows/AltiumComponent/StandardDocumentation?Versionid=630021; Supplier 1: Farnell; Supplier Part Number 1: 1696060; Supplier 2: DigiKey; Supplier Part Number 2: 3361P-103GLFCT-ND; Supplier 3: Mouser; Supplier Part Number 3: 652-3361P-1-103GLF; Second Source allowed: Yes; Package Description: Potentiometer, SMD; 3 pin, 7.04 mm L X 6.71 mm W X 5.84 mm H Body
R631 R633 = 345662: as R722 on sheet Output; Legacy DeviceID: RES01801155; Part Type: Resistor; Value: 1.3k; Tolerance Neg: 1%; Tolerance Pos: 1%; Type: Standard; Technology: Thick Film; Temperature min: -55; Temperature max: 155; Temperature Range: Military; ROHS Compliant: Y; PackageReference: 0603; ComponentLink1Description: Vendor WebSite; ComponentLink1URL: http://www.vishay.com; ComponentLink2Description: Datasheet; ComponentLink2URL: http://webnetprod.muc.infineon.com/PCBPortal_Prod/WorkFlows/AltiumComponent/StandardDocumentation?Versionid=345663; Supplier 1: Farnell; Supplier 2: DigiKey; Supplier 3: Mouser; Second Source allowed: Yes
R632 R634 = 346637: RES / STD / 64.9k / 100mW / 1% / 100ppm/K / -55°C to 155°C / 0603 / SMD / -; Multiple Parts: No; Legacy PartNumber: RES01801350; Manufacturer: Vishay; Manufacturer Order Number: CRCW060364K9FK; Symbol Type: Resistor; Single; Standard; 2 Pins; Alternate View: Yes; Article Number: 346637; Version Number: V01; Combined Parameters: TCR:100ppm/K;Tol.:-1%/+1%;Vdc:75V;Idc:-;P:100mW; QuickPick: 64.9k / 1% / 0.1 / 0603; Style: Single; Automotive Qualified: AEC Q200; ComponentStatus: Released; PLMStatus: Active; Voltage DC (max): 75V; Legacy DeviceID: RES01801350; Part Type: Resistor; Value: 64.9k; Tolerance Neg: 1%; Tolerance Pos: 1%; Type: Standard; Technology: Thick Film; Temperature min: -55; Temperature max: 155; Temperature Range: Military; ROHS Compliant: Y; PackageReference: 0603; ComponentLink1Description: Vendor WebSite; ComponentLink1URL: http://www.vishay.com; ComponentLink2Description: Datasheet; ComponentLink2URL: http://webnetprod.muc.infineon.com/PCBPortal_Prod/WorkFlows/AltiumComponent/StandardDocumentation?Versionid=346638; Supplier 1: Farnell; Supplier 2: DigiKey; Supplier 3: Mouser; Second Source allowed: Yes
TP600 TP610 TP611 TP630 = 387486: Test Terminal, Surface Mount (Tape and Reeled Components); Multiple Parts: No; Legacy PartNumber: CON01501015; Manufacturer: Harwin; Symbol Type: Connector, 1 Lead, Female; Alternate View: Yes; Article Number: 387486; Version Number: V01; Legacy DeviceID: HAR_S1751-46R; Combined Parameters: Board-to-Cable None (onboard);1x1;Mounting:SMT;Orient:None (onboard);Shielded:No; QuickPick: None (onboard) / Board-to-Cable; Style: Not Applicable; ComponentStatus: Released; PLMStatus: Active; Voltage DC (max): na; Part Type: Connector; Manufacturer Order Number: S1751-46R; Value: S1751-46R; Type: Board-to-Cable; Application: Test; Temperature min: 0; Temperature max: 0; Temperature Range: Military; ROHS Compliant: Y; Automotive Qualified: No; ComponentLink1Description: Vendor WebSite; ComponentLink1URL: http://www.harwin.com/; ComponentLink2Description: Datasheet; ComponentLink2URL: http://webnetprod.muc.infineon.com/PCBPortal_Prod/WorkFlows/AltiumComponent/StandardDocumentation?Versionid=387487; Supplier 1: Farnell; Supplier Part Number 1: 2411184; Supplier 2: DigiKey; Supplier Part Number 2: 952-1478-2-ND; Supplier 3: Mouser; Supplier Part Number 3: 855-S1751-46R; Second Source allowed: Yes; Package Description: Test Terminal, SMD, 3.25mm L X 1.65mm W X 2.15mm H body
U600 = 644045: Low-Cost, Voltage-Output, High-Side Current-Sense Amplifier; Manufacturer: Maxim Integrated Products; Alternate View: No; Article Number: 644045; Version Number: V01; Legacy DeviceID: MIP_MAX4073FAUT+T; Combined Parameters: Res.:-;Fmax:-; QuickPick: Amplifier / SOT23-6; Automotive Qualified: Yes; ComponentStatus: Released; PLMStatus: Active; Voltage DC (max): na; Symbol Type: Low-Cost, Voltage-Output, High-Side Current-Sense Amplifier; Multiple Parts: No; Part Type: Analog Parts; Manufacturer Order Number: MAX4073FAUT+T; Value: MAX4073FAUT+T; Type: Amplifier; Application: Power Supply; Temperature min: -40; Temperature max: 125; Temperature Range: Automotive; ROHS Compliant: Y; PackageReference: SOT23-6; ComponentLink1Description: Vendor WebSite; ComponentLink1URL: http://www.maxim-ic.com/; ComponentLink2Description: Datasheet; ComponentLink2URL: http://webnetprod.muc.infineon.com/PCBPortal_Prod/WorkFlows/AltiumComponent/StandardDocumentation?Versionid=644046; Supplier 1: Farnell; Supplier Part Number 1: 2515284; Supplier 2: DigiKey; Supplier Part Number 2: MAX4073FAUT+TCT-ND; Supplier 3: Mouser; Supplier Part Number 3: 700-MAX4073FAUT+T; Second Source allowed: Yes; Package Description: SOT,0.95mm pitch;6 pin,1.625mm W X 2.90mm L X 1.45mm H body
U610 = 645975: Current Sense Amplifiers Current-Sense Amplifier W / PWM Rejection; Manufacturer: Maxim Integrated Products; Alternate View: No; Symbol Type: Bidirectional Current Sense Amplifier with PWM-Rejection; Article Number: 645975; Version Number: V01; Legacy DeviceID: MIP_MAX40056TAUA+; Combined Parameters: Res.:-;Fmax:-; QuickPick: Amplifier / uMAX-8; Automotive Qualified: AEC Q100; ComponentStatus: Released; PLMStatus: Active; Second Source allowed: Yes; Voltage DC (max): na; Multiple Parts: No; Part Type: Analog Parts; Manufacturer Order Number: MAX40056TAUA+; Value: MAX40056TAUA+; Type: Amplifier; Application: Power Electronics; Temperature min: -40; Temperature max: 125; Temperature Range: Automotive; ROHS Compliant: Y; PackageReference: uMAX-8; ComponentLink1Description: Vendor WebSite; ComponentLink1URL: http://www.maxim-ic.com/; ComponentLink2Description: Datasheet; ComponentLink2URL: http://webnetprod.muc.infineon.com/PCBPortal_Prod/WorkFlows/AltiumComponent/StandardDocumentation?Versionid=645976; Supplier 1: Farnell; Supplier Part Number 1: 3288156; Supplier 2: DigiKey; Supplier Part Number 2: 175-MAX40056TAUA+-ND; Supplier 3: Mouser; Supplier Part Number 3: 700-MAX40056TAUA+; Package Description: SOP,0.65mm pitch;8 pin,3.00mm W X 3.00mm L X 1.10mm H body
U630 = 648334: Automotive, High-Voltage, Precision, Rail-to-Rail In, Rail-to-Rail Out Op Amp, Inverter and Motor Control Applications; Manufacturer: Texas Instruments; Symbol Type: High-Precision, Low-Noise, Rail-to-Rail Output, JFET Op Amp; Alternate View: Yes; Article Number: 648334; Version Number: V00; Legacy DeviceID: TI_TLV197QDGKRQ1; Combined Parameters: Res.:-;Fmax:-; QuickPick: Amplifier / VSSOP-8(DGK); Automotive Qualified: AEC Q100; ComponentStatus: Released; PLMStatus: Active; Voltage DC (max): na; Multiple Parts: Yes; Part Type: Analog Parts; Manufacturer Order Number: TLV197QDGKRQ1; Value: TLV197QDGKRQ1; Type: Amplifier; Application: Power Supply; Temperature min: -40; Temperature max: 125; Temperature Range: Automotive; ROHS Compliant: Y; PackageReference: VSSOP-8(DGK); ComponentLink1Description: Vendor WebSite; ComponentLink1URL: http://www.ti.com; ComponentLink2Description: Datasheet; ComponentLink2URL: http://webnetprod.muc.infineon.com/PCBPortal_Prod/WorkFlows/AltiumComponent/StandardDocumentation?Versionid=648335; Supplier 1: Farnell; Supplier 2: DigiKey; Supplier Part Number 2: 296-TLV197QDGKRQ1CT-ND; Supplier 3: Mouser; Supplier Part Number 3: 595-TLV197QDGKRQ1; Second Source allowed: Yes; Package Description: SOP,0.65mm pitch;8 pin,3.00mm W X 3.00mm L X 1.10mm H body

## Sheet User.SchDoc: <Project Name>
size A3; ApprovedBy: <Appr.>; Author: <Author>; CompanyName: Infineon Technologies AG; Engineer: <Rel.>; Organization: Infineon Technologies AG; Address1: IFAG DES S PS; Address2: Am Campeon 1-12  -  85579 Neubiberg  -  Germany; Address3: 85579 Neubiberg; Address4: Germany; DocumentNumber: 9; Revision: <Rev.>; SheetNumber: 9; SheetTotal: 9; Release: RC00; PageSetup: Record=PageOptions|CenterHorizontal=True|CenterVertical=True|PrintScale=1.01|XCorrection=1.00|YCorrection=1.00|PrintKind=0|BorderSize=5000000|LeftOffset=0|BottomOffset=0|Orientation=2|PaperLength=1000|PaperWidth=1000|Scale=100|PaperSource=7|PrintQuality=-4|MediaType=1|DitherType=10|PaperKind=A3|PrintScaleMode=1; Doc_ConfidentialStatus: <Doc_ConfidentialStatus>; Doc_Preliminary: <Doc_Preliminary>
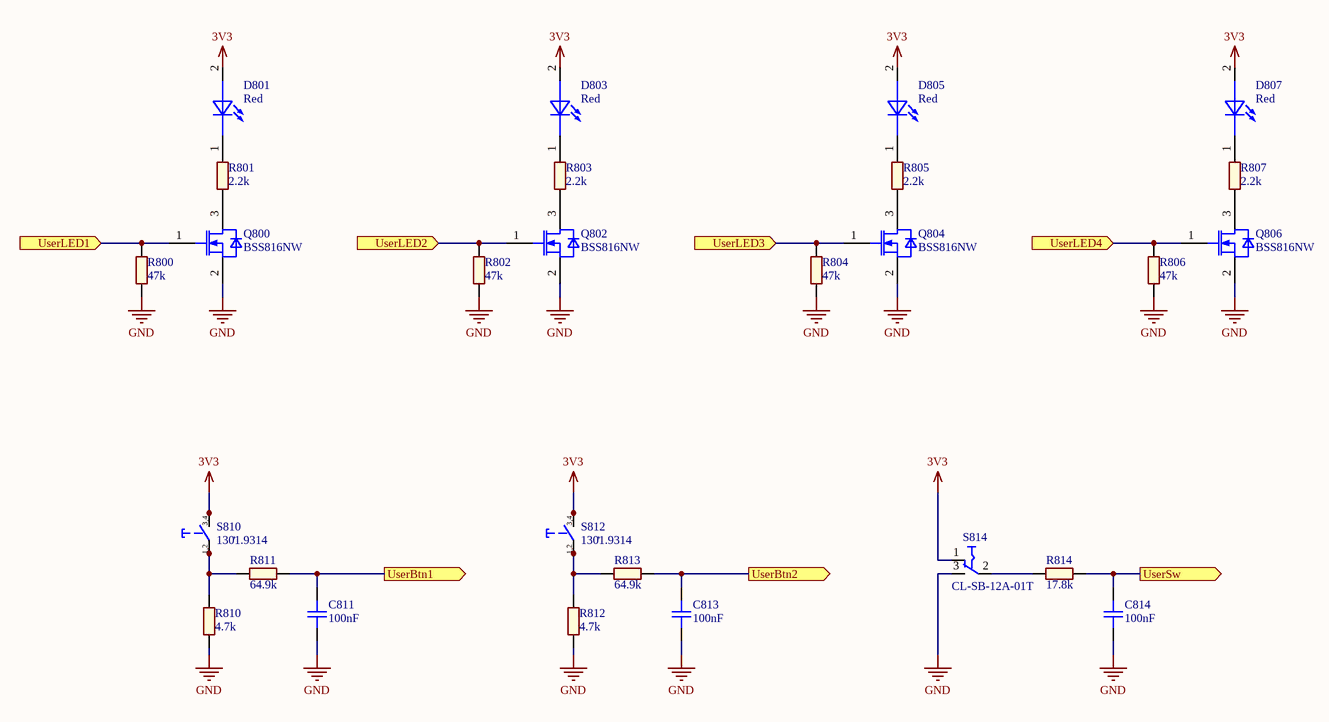
[diagram p7: User.SchDoc]

### Parts
C811  100nF  [CAPC1608X90N-2]
C813  100nF  [CAPC1608X90N-2]
C814  100nF  [CAPC1608X90N-2]
D801  Red  [LEDSC160X80X80-2N-1]
D803  Red  [LEDSC160X80X80-2N-1]
D805  Red  [LEDSC160X80X80-2N-1]
D807  Red  [LEDSC160X80X80-2N-1]
Q800  BSS816NW  [SOT65P210X100-3N-1-V]
Q802  BSS816NW  [SOT65P210X100-3N-1-V]
Q804  BSS816NW  [SOT65P210X100-3N-1-V]
Q806  BSS816NW  [SOT65P210X100-3N-1-V]
R800  47k  [RESC1609X50N]
R801  2.2k  [RESC1609X50N]
R802  47k  [RESC1609X50N]
R803  2.2k  [RESC1609X50N]
R804  47k  [RESC1609X50N]
R805  2.2k  [RESC1609X50N]
R806  47k  [RESC1609X50N]
R807  2.2k  [RESC1609X50N]
R810  4.7k  [RESC1609X50N]
R811  64.9k  [RESC1609X50N]
R812  4.7k  [RESC1609X50N]
R813  64.9k  [RESC1609X50N]
R814  17.8k  [RESC1609X50N]
S810  1301.9314  [SW-SMD-1301.9314]
S812  1301.9314  [SW-SMD-1301.9314]
S814  CL-SB-12A-01T  [SW-SMD-CL-SB-12A-01T]

### Ports
UserBtn1 (out), UserBtn2 (out), UserLED1 (in), UserLED2 (in), UserLED3 (in), UserLED4 (in), UserSw (out)

### Nets
3V3: D801.2(Anode) D803.2(Anode) D805.2(Anode) D807.2(Anode) S810.3 S810.4 S812.3 S812.4 S814.1
GND: C811.1 C813.1 C814.1 Q800.2(SOURCE) Q802.2(SOURCE) Q804.2(SOURCE) Q806.2(SOURCE) R800.1 R802.1 R804.1 R806.1 R810.1 R812.1 S814.3
UserBtn1: C811.2 R811.1 ; port UserBtn1
UserBtn2: C813.2 R813.1 ; port UserBtn2
UserLED1: Q800.1(GATE) R800.2 ; port UserLED1
UserLED2: Q802.1(GATE) R802.2 ; port UserLED2
UserLED3: Q804.1(GATE) R804.2 ; port UserLED3
UserLED4: Q806.1(GATE) R806.2 ; port UserLED4
UserSw: C814.2 R814.1 ; port UserSw
NetD801_1: D801.1(Cathode) R801.1
NetD803_1: D803.1(Cathode) R803.1
NetD805_1: D805.1(Cathode) R805.1
NetD807_1: D807.1(Cathode) R807.1
NetQ800_3: Q800.3(DRAIN) R801.2
NetQ802_3: Q802.3(DRAIN) R803.2
NetQ804_3: Q804.3(DRAIN) R805.2
NetQ806_3: Q806.3(DRAIN) R807.2
NetR810_2: R810.2 R811.2 S810.1 S810.2
NetR812_2: R812.2 R813.2 S812.1 S812.2
NetR814_2: R814.2 S814.2

### Notes on the sheet
- ,
- Title
- Variant
- Approved
- Date:
- Author:
- Size:
- A3
- Document Name
- Time:
- SVN Revision:
- Rel.
- Rev.
- Sheet
- of
- (in symbol 380147) 3,4; 1,2

### Library data of the parts
C811 C813 C814 = 479045: as C750 on sheet Output; Part Type: Capacitor; Value: 100nF; Tolerance Neg: 10%; Tolerance Pos: 10%; Application: Standard; Technology: Ceramic; Temperature min: -55; Temperature max: 125; Temperature Range: Military; ROHS Compliant: Y; Automotive Qualified: No; PackageReference: 0603; ComponentLink1Description: Vendor WebSite; ComponentLink1URL: http://www.avx.com; ComponentLink2Description: Datasheet; ComponentLink2URL: http://webnetprod.muc.infineon.com/PCBPortal_Prod/WorkFlows/AltiumComponent/StandardDocumentation?Versionid=479046; Supplier 1: Farnell; Supplier Part Number 1: 2280883; Supplier 2: DigiKey; Supplier Part Number 2: 478-5052-2-ND; Supplier 3: Mouser; Supplier Part Number 3: 581-06035C104KAT2A; Second Source allowed: Yes; Voltage DC (max): 50V; Package Description: Capacitor,non-polarized,Chip;1.60mm L X 0.81mm W X 0.90mm H
D801 D803 D805 D807 = 625459: as D550-D553 on sheet Safety; Part Type: Diode; Value: Red; Type: LED; Application: Standard; Temperature min: -40; Temperature max: 85; Temperature Range: Industrial; ROHS Compliant: Y; PackageReference: 1608 (0603); ComponentLink1Description: Vendor WebSite; ComponentLink1URL: http://www.we-online.com; ComponentLink2Description: Datasheet; ComponentLink2URL: http://webnetprod.muc.infineon.com/PCBPortal_Prod/WorkFlows/AltiumComponent/StandardDocumentation?Versionid=625460; Supplier 1: Farnell; Supplier Part Number 1: 2322071; Supplier 2: DigiKey; Supplier Part Number 2: 732-4978-1-ND; Supplier 3: Mouser; Supplier Part Number 3: 710-150060RS75000; Package Description: LED,Side Concave; 2 pin,1.60mm W X 0.80mm L X 0.80mm H
Q800 Q802 Q804 Q806 = 644598: as Q550-Q553 on sheet Safety; Part Type: Transistor FET; Manufacturer Order Number: BSS816NW; Value: BSS816NW; Application: Small Signal; Temperature min: -55; Temperature max: 150; Temperature Range: Military; ROHS Compliant: Y; PackageReference: PG-SOT323-3-2; ComponentLink1Description: Vendor WebSite; ComponentLink1URL: https://www.infineon.com/; ComponentLink2Description: Datasheet; ComponentLink2URL: http://webnetprod.muc.infineon.com/PCBPortal_Prod/WorkFlows/AltiumComponent/StandardDocumentation?Versionid=644599; Supplier 1: Farnell; Supplier Part Number 1: 2617470; Supplier 2: DigiKey; Supplier Part Number 2: BSS816NWH6327XTSA1CT-ND; Supplier 3: Mouser; Supplier Part Number 3: 726-SP000917562; Package Description: SOT,0.65mm pitch;3 pin,1.25mm W X 2.00mm L X 1.00mm H body
R800 R802 R804 R806 = 346552: RES / STD / 47k / 100mW / 1% / 100ppm/K / -55°C to 155°C / 0603 / SMD / -; Multiple Parts: No; Legacy PartNumber: RES01801333; Manufacturer: Vishay; Manufacturer Order Number: CRCW060347K0FK; Symbol Type: Resistor; Single; Standard; 2 Pins; Alternate View: Yes; Article Number: 346552; Version Number: V01; Combined Parameters: TCR:100ppm/K;Tol.:-1%/+1%;Vdc:75V;Idc:-;P:100mW; QuickPick: 47k / 1% / 0.1 / 0603; Style: Single; Automotive Qualified: AEC Q200; ComponentStatus: Released; PLMStatus: Active; Voltage DC (max): 75V; Legacy DeviceID: RES01801333; Part Type: Resistor; Value: 47k; Tolerance Neg: 1%; Tolerance Pos: 1%; Type: Standard; Technology: Thick Film; Temperature min: -55; Temperature max: 155; Temperature Range: Military; ROHS Compliant: Y; PackageReference: 0603; ComponentLink1Description: Vendor WebSite; ComponentLink1URL: http://www.vishay.com; ComponentLink2Description: Datasheet; ComponentLink2URL: http://webnetprod.muc.infineon.com/PCBPortal_Prod/WorkFlows/AltiumComponent/StandardDocumentation?Versionid=346553; Supplier 1: Farnell; Supplier 2: DigiKey; Supplier Part Number 2: 541-47.0KHCT-ND; Supplier 3: Mouser; Second Source allowed: Yes
R801 R803 R805 R807 = 345782: RES / STD / 2.2k / 100mW / 1% / 100ppm/K / -55°C to 155°C / 0603 / SMD / -; Multiple Parts: No; Legacy PartNumber: RES01801179; Manufacturer: Vishay; Manufacturer Order Number: CRCW06032K20FK; Symbol Type: Resistor; Single; Standard; 2 Pins; Alternate View: Yes; Article Number: 345782; Version Number: V01; Combined Parameters: TCR:100ppm/K;Tol.:-1%/+1%;Vdc:75V;Idc:-;P:100mW; QuickPick: 2.2k / 1% / 0.1 / 0603; Style: Single; Automotive Qualified: AEC Q200; ComponentStatus: Released; PLMStatus: Active; Voltage DC (max): 75V; Legacy DeviceID: RES01801179; Part Type: Resistor; Value: 2.2k; Tolerance Neg: 1%; Tolerance Pos: 1%; Type: Standard; Technology: Thick Film; Temperature min: -55; Temperature max: 155; Temperature Range: Military; ROHS Compliant: Y; PackageReference: 0603; ComponentLink1Description: Vendor WebSite; ComponentLink1URL: http://www.vishay.com; ComponentLink2Description: Datasheet; ComponentLink2URL: http://webnetprod.muc.infineon.com/PCBPortal_Prod/WorkFlows/AltiumComponent/StandardDocumentation?Versionid=345783; Supplier 1: Farnell; Supplier 2: DigiKey; Supplier 3: Mouser; Second Source allowed: Yes
R810 R812 = 345982: as R750 on sheet Output; Legacy DeviceID: RES01801219; Part Type: Resistor; Value: 4.7k; Tolerance Neg: 1%; Tolerance Pos: 1%; Type: Standard; Technology: Thick Film; Temperature min: -55; Temperature max: 155; Temperature Range: Military; ROHS Compliant: Y; PackageReference: 0603; ComponentLink1Description: Vendor WebSite; ComponentLink1URL: http://www.vishay.com; ComponentLink2Description: Datasheet; ComponentLink2URL: http://webnetprod.muc.infineon.com/PCBPortal_Prod/WorkFlows/AltiumComponent/StandardDocumentation?Versionid=345983; Supplier 1: Farnell; Supplier 2: DigiKey; Supplier 3: Mouser; Second Source allowed: Yes
R811 R813 = 346637: as R632 on sheet CurrentSensors; Legacy DeviceID: RES01801350; Part Type: Resistor; Value: 64.9k; Tolerance Neg: 1%; Tolerance Pos: 1%; Type: Standard; Technology: Thick Film; Temperature min: -55; Temperature max: 155; Temperature Range: Military; ROHS Compliant: Y; PackageReference: 0603; ComponentLink1Description: Vendor WebSite; ComponentLink1URL: http://www.vishay.com; ComponentLink2Description: Datasheet; ComponentLink2URL: http://webnetprod.muc.infineon.com/PCBPortal_Prod/WorkFlows/AltiumComponent/StandardDocumentation?Versionid=346638; Supplier 1: Farnell; Supplier 2: DigiKey; Supplier 3: Mouser; Second Source allowed: Yes
R814 = 346302: as R721 on sheet Output; Legacy DeviceID: RES01801283; Part Type: Resistor; Value: 17.8k; Tolerance Neg: 1%; Tolerance Pos: 1%; Type: Standard; Technology: Thick Film; Temperature min: -55; Temperature max: 155; Temperature Range: Military; ROHS Compliant: Y; PackageReference: 0603; ComponentLink1Description: Vendor WebSite; ComponentLink1URL: http://www.vishay.com; ComponentLink2Description: Datasheet; ComponentLink2URL: http://webnetprod.muc.infineon.com/PCBPortal_Prod/WorkFlows/AltiumComponent/StandardDocumentation?Versionid=346303; Supplier 1: Farnell; Supplier 2: DigiKey; Supplier 3: Mouser; Second Source allowed: Yes
S810 S812 = 380147: Pushbutton Tactile Switch, Single Pole Single Throw, 4 Pins; Legacy PartNumber: CON01500305; Manufacturer: Schurter; Symbol type: Tactile Switch, Spring Return, Single Pole Single Throw - Normally Open, 4 Pins; Article Number: 380147; Version Number: V01; Legacy DeviceID: SCH_1301.9314; ComponentStatus: Released; PLMStatus: Active; Second Source allowed: Yes; Voltage DC (max): na; Part Type: Electro Mechanic; Manufacturer Order Number: 1301.9314; Value: 1301.9314; Temperature min: -20; Temperature max: 70; Temperature Range: Commercial; ROHS Compliant: Y; ComponentLink1Description: Vendor WebSite; ComponentLink1URL: http://www.schurter.com.sg/; ComponentLink2Description: Datasheet; ComponentLink2URL: http://webnetprod.muc.infineon.com/PCBPortal_Prod/WorkFlows/AltiumComponent/StandardDocumentation?Versionid=380148; Supplier 1: Farnell; Supplier Part Number 1: 1217763; Supplier 2: DigiKey; Supplier Part Number 2: 1301.9314-ND; Supplier 3: Mouser; Supplier Part Number 3: 693-1301.9314; Package Description: SMD Switch, 6.00mm L X 6.00mm W X 4.3mm H body
S814 = 650099: as S750-S752 on sheet Output; Part Type: Electro Mechanic; Manufacturer Order Number: CL-SB-12A-01T; Value: CL-SB-12A-01T; Application: Power; Temperature min: -40; Temperature max: 85; Temperature Range: Industrial; ROHS Compliant: Y; ComponentLink1Description: Vendor WebSite; ComponentLink1URL: www.copal-electronics.com/; ComponentLink2Description: Datasheet; ComponentLink2URL: http://webnetprod.muc.infineon.com/PCBPortal_Prod/WorkFlows/AltiumComponent/StandardDocumentation?Versionid=650100; Supplier 1: Farnell; Supplier Part Number 1: 2854744; Supplier 2: DigiKey; Supplier Part Number 2: 563-1314-1-ND; Supplier 3: Mouser; Supplier Part Number 3: 229-CL-SB-12A-01T; Package Description: Switch, SMD, 3 Pins, 3.50 mm W X 8.50 mm L X 6.10 mm H body

## Nets that join several sheets
3V3: 02_Top_Level (7 pins), PowerStage (D404.2 D434.2 R405.2 R435.1), PowerSupply (C311.2 C312.2 G310.3), Safety (29 pins), Output (6 pins), CurrentSensors (C610.2 U610.3), User (9 pins)
5V: 02_Top_Level (D112.2 X140.3), PowerSupply (6 pins)
12V: 02_Top_Level (X140.2), PowerStage (7 pins), PowerSupply (C301.2 G300.9 R301.2), Safety (C500.1 C520.1 U500.3 U520.3), Output (D741.2 D743.2 D745.2), CurrentSensors (C600.2 C630.2 U600.3 U630.7)
GND: 02_Top_Level (21 pins), Input (14 pins), PowerStage (8 pins), PowerSupply (17 pins), Safety (45 pins), Output (21 pins), CurrentSensors (9 pins), User (14 pins)
Out_neg: 02_Top_Level (R103.1 X103.1 X103.2), Output (9 pins)
~{Cntrl1}: 02_Top_Level (JP125.2), Output (D740.2)
~{Cntrl2}: 02_Top_Level (JP126.2), Output (D742.2)
~{Cntrl3}: 02_Top_Level (JP127.2), Output (D744.2)
~{Shutdown}: 02_Top_Level (R112.1), PowerStage (U400.2 U430.2), Safety (U570.1)
Boost_Cntrl: 02_Top_Level (JP124.2 R123.2), PowerStage (R434.1)
Buck_Cntrl: 02_Top_Level (JP122.2 Q124.1 R122.2), PowerStage (R404.1)
Curr_In+: Input (R211.4), CurrentSensors (U600.4)
Curr_In-: Input (R211.3), CurrentSensors (U600.5)
Curr_Inductor+: PowerStage (R420.3), CurrentSensors (U610.1)
Curr_Inductor-: PowerStage (R420.4), CurrentSensors (U610.8)
Curr_Out+: 02_Top_Level (R103.3), Safety (R515.1), CurrentSensors (R631.1)
Curr_Out-: 02_Top_Level (R103.4), Safety (C514.1 R514.2), CurrentSensors (R633.1)
Inductor_Current: 02_Top_Level (R131.2 X140.8), CurrentSensors (TP610.1 U610.4)
Inductor_Overcurr: 02_Top_Level (JP112.5), CurrentSensors (U610.2)
Input_Current: 02_Top_Level (R110.2 X140.6), Safety (R506.2), CurrentSensors (TP600.1 U600.6)
Load1: 02_Top_Level (X150.3 X150.4), Output (Q741.5 Q741.6 Q741.7 Q741.8)
Load2: 02_Top_Level (X150.5 X150.6), Output (Q743.5 Q743.6 Q743.7 Q743.8)
Load3: 02_Top_Level (X150.7 X150.8), Output (Q745.5 Q745.6 Q745.7 Q745.8)
NTC_ext: 02_Top_Level (JP120.1 X150.9), Safety (C533.2 R532.2 TP532.1 U520.10)
NTC_int: 02_Top_Level (JP120.3), Safety (5 pins)
Output_Current: 02_Top_Level (R111.2 X140.7), Safety (R507.2), CurrentSensors (R634.2 TP630.1 U630.6)
SW_Curr+: PowerStage (R421.3 TP421.1), Safety (R511.1)
SW_Curr-: PowerStage (R421.4 TP421.2), Safety (C510.1 R510.2)
UserBtn1: 02_Top_Level (JP112.7), User (C811.2 R811.1)
UserBtn2: 02_Top_Level (JP112.15), User (C813.2 R813.1)
UserLED1: 02_Top_Level (JP112.9 JP125.1), User (Q800.1 R800.2)
UserLED2: 02_Top_Level (JP112.11 JP126.1), User (Q802.1 R802.2)
UserLED3: 02_Top_Level (JP111.7 JP127.1), User (Q804.1 R804.2)
UserLED4: 02_Top_Level (JP111.11), User (Q806.1 R806.2)
UserSw: 02_Top_Level (JP111.9), User (C814.2 R814.1)
Vin: Input (7 pins), PowerStage (5 pins)
Vin_Meas: 02_Top_Level (D111.1 JP110.7), Input (C221.2 R220.2 R221.2)
Vin_Raw: 02_Top_Level (X100.1 X100.2), Input (Q200.2)
Vin_VoltReg: 02_Top_Level (X140.1), Input (6 pins), PowerSupply (9 pins)
Vout: 02_Top_Level (5 pins), PowerStage (6 pins), Output (8 pins)
Vout_Meas: 02_Top_Level (D111.2 JP110.9 X140.10), Safety (U500.7), Output (C722.2 JP723.1 R721.2 R722.2)

## Assembly variants
Default_Assembly: not fitted C312 C511 C515 JP421 MP100 MP101 MP102 MP103 TP611 X110
OnlySMD: not fitted C210 C312 C511 C515 JP110 JP110 JP111 JP111 JP111 JP112 JP120 JP121 JP122 JP123 JP124 JP125 JP126 JP127 JP128 JP130 JP212 JP421 JP421 JP701 JP710 JP710 JP710 MP100 MP101 MP102 MP103 R509 R513 TP100 TP101 TP102 TP103 TP103 TP104 TP105 TP106 TP107 TP202 TP300 TP421 TP421 TP503 TP611 TP710 TP802 X110 X140 X140 X140 X140 X140 X140 X150 X720